# EAGLE design pCog100_Wifi_Sensor_TFT (EAGLE 6.6.0)

## Sheet 1 of 4
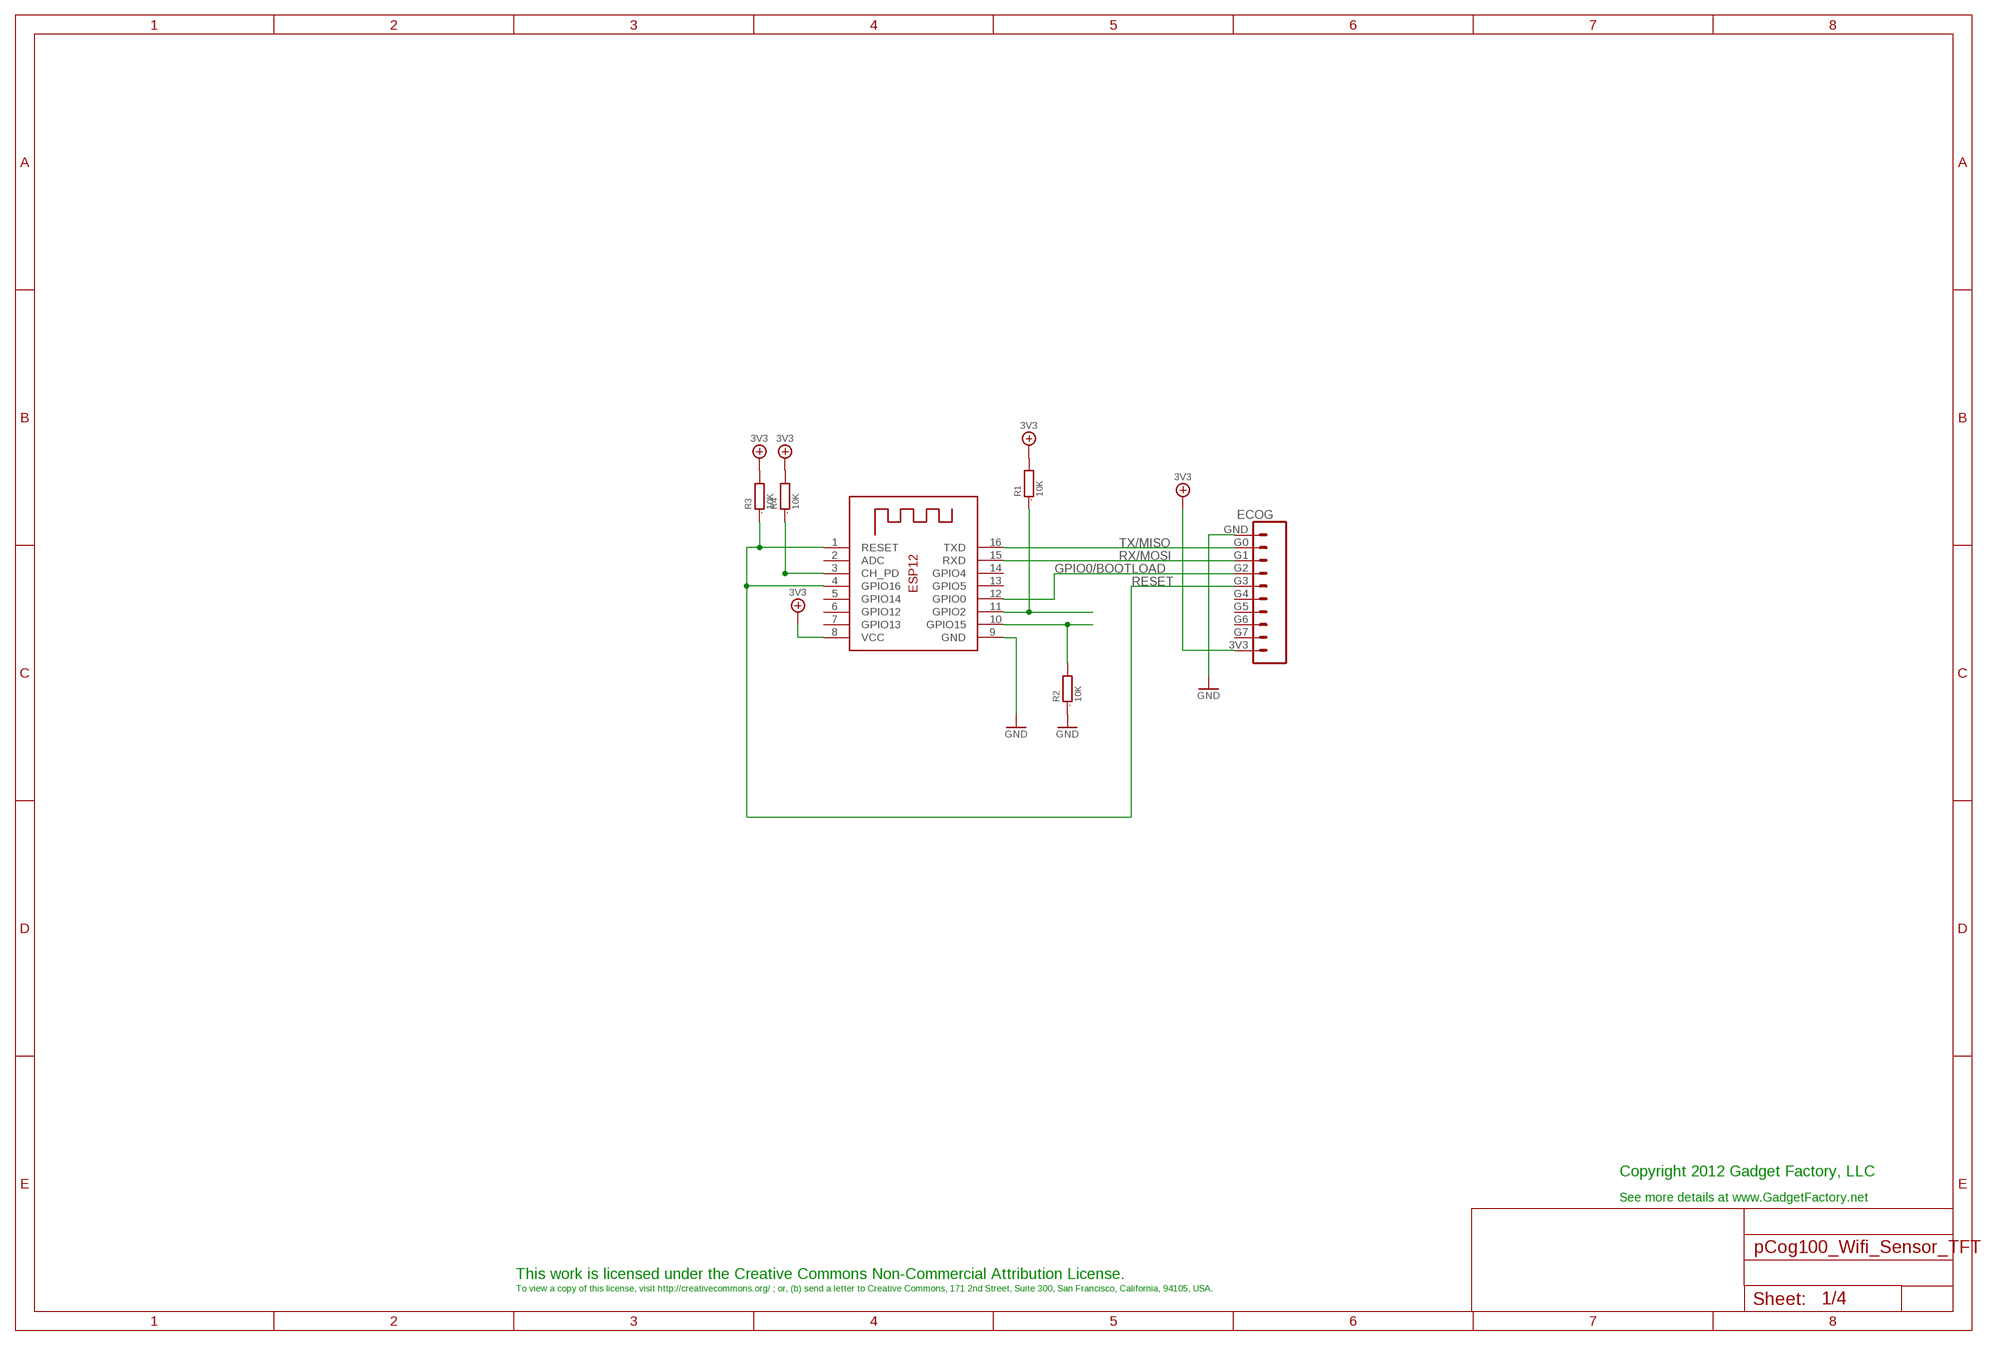
[diagram p0: schematic, sheet 1]

### Parts
ECOG  ECOG_GENERAL_ROWTHROUGHOLE  [ECOG_GENERAL_TH]
R1  10K  R0805  [0805]
R2  10K  R0805  [0805]
R3  10K  R0805  [0805]
R4  10K  R0805  [0805]
X1  ESP-12  [ESP-12]

### Nets
3V3: ECOG.3V3 R1.2 R3.2 R4.2 X1.8(VCC) ; also sheet 2,3,4
GND: ECOG.GND R2.1 X1.9(GND) ; also sheet 2,3,4
GPIO0/BOOTLOAD: ECOG.G2 X1.12(GPIO0)
N$3: R1.1 X1.11(GPIO2)
N$4: R2.2 X1.10(GPIO15)
N$5: R4.1 X1.3(CH_PD)
RESET: ECOG.G3 R3.1 X1.1(RESET) X1.4(GPIO16)
RX/MOSI: ECOG.G1 X1.15(RXD)
TX/MISO: ECOG.G0 X1.16(TXD)
Unconnected: ECOG.G4 ECOG.G5 ECOG.G6 ECOG.G7 X1.2(ADC) X1.5(GPIO14) X1.6(GPIO12) X1.7(GPIO13) X1.13(GPIO5) X1.14(GPIO4)

### Notes on the sheet
- Copyright 2012 Gadget Factory, LLC
- See more details at www.GadgetFactory.net
- This work is licensed under the Creative Commons Non-Commercial Attribution License.
- To view a copy of this license, visit http://creativecommons.org/ ; or, (b) send a letter to Creative Commons, 171 2nd Street, Suite 300, San Francisco, California, 94105, USA.

## Sheet 2 of 4
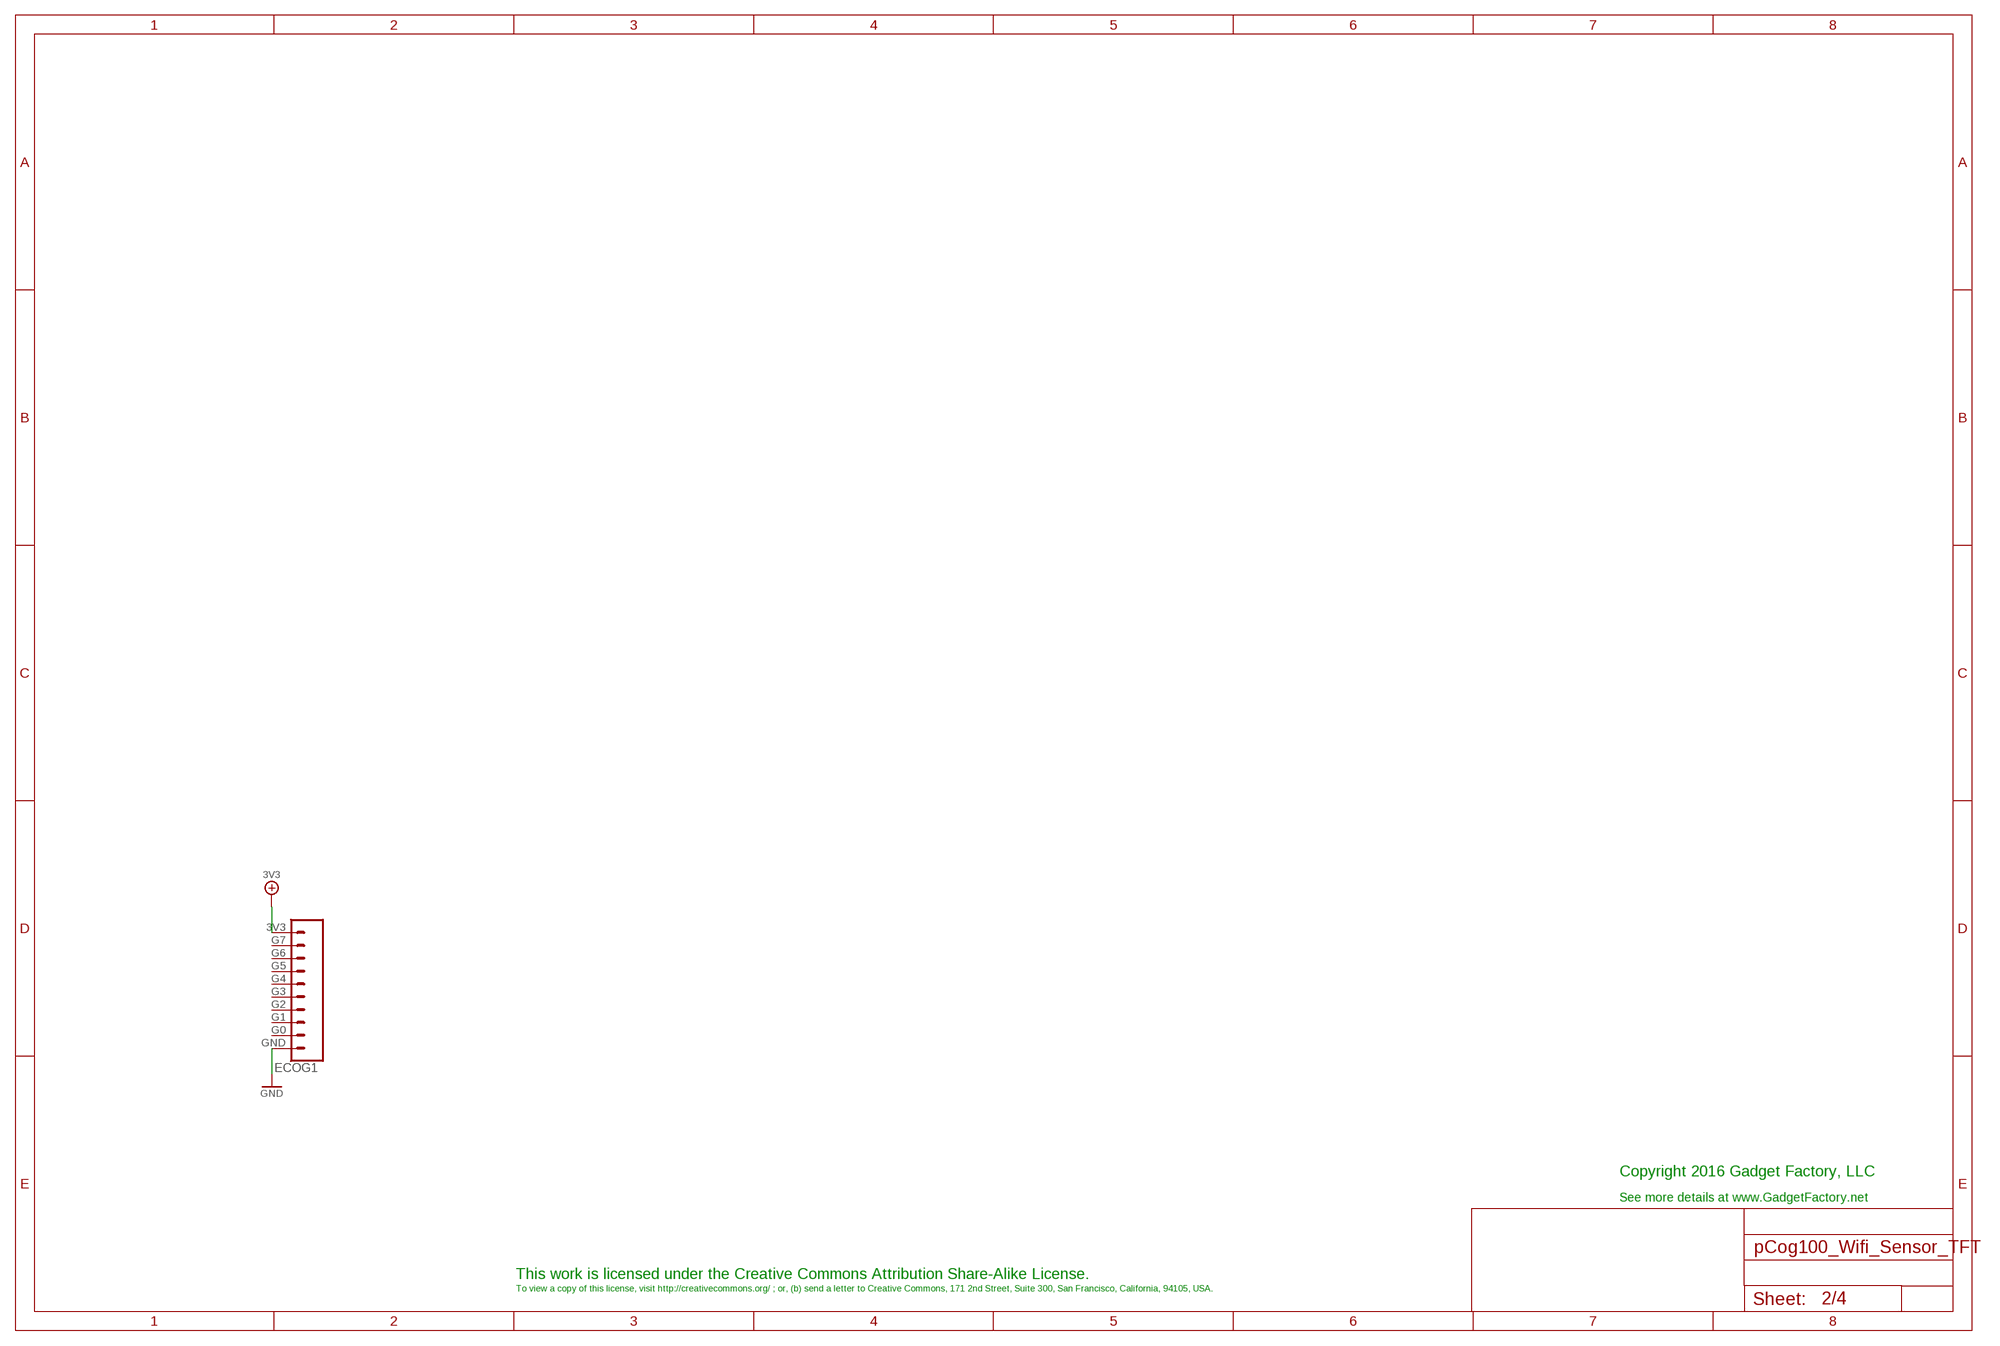
[diagram p1: schematic, sheet 2]

### Parts
ECOG1  ECOG_GENERAL_ROWSURFACEMOUNT  [ECOG_GENERAL_SMD]

### Nets
3V3: ECOG1.3V3 ; also sheet 1,3,4
GND: ECOG1.GND ; also sheet 1,3,4
Unconnected: ECOG1.G0 ECOG1.G1 ECOG1.G2 ECOG1.G3 ECOG1.G4 ECOG1.G5 ECOG1.G6 ECOG1.G7

### Notes on the sheet
- Copyright 2016 Gadget Factory, LLC
- See more details at www.GadgetFactory.net
- This work is licensed under the Creative Commons Attribution Share-Alike License.
- To view a copy of this license, visit http://creativecommons.org/ ; or, (b) send a letter to Creative Commons, 171 2nd Street, Suite 300, San Francisco, California, 94105, USA.

## Sheet 3 of 4
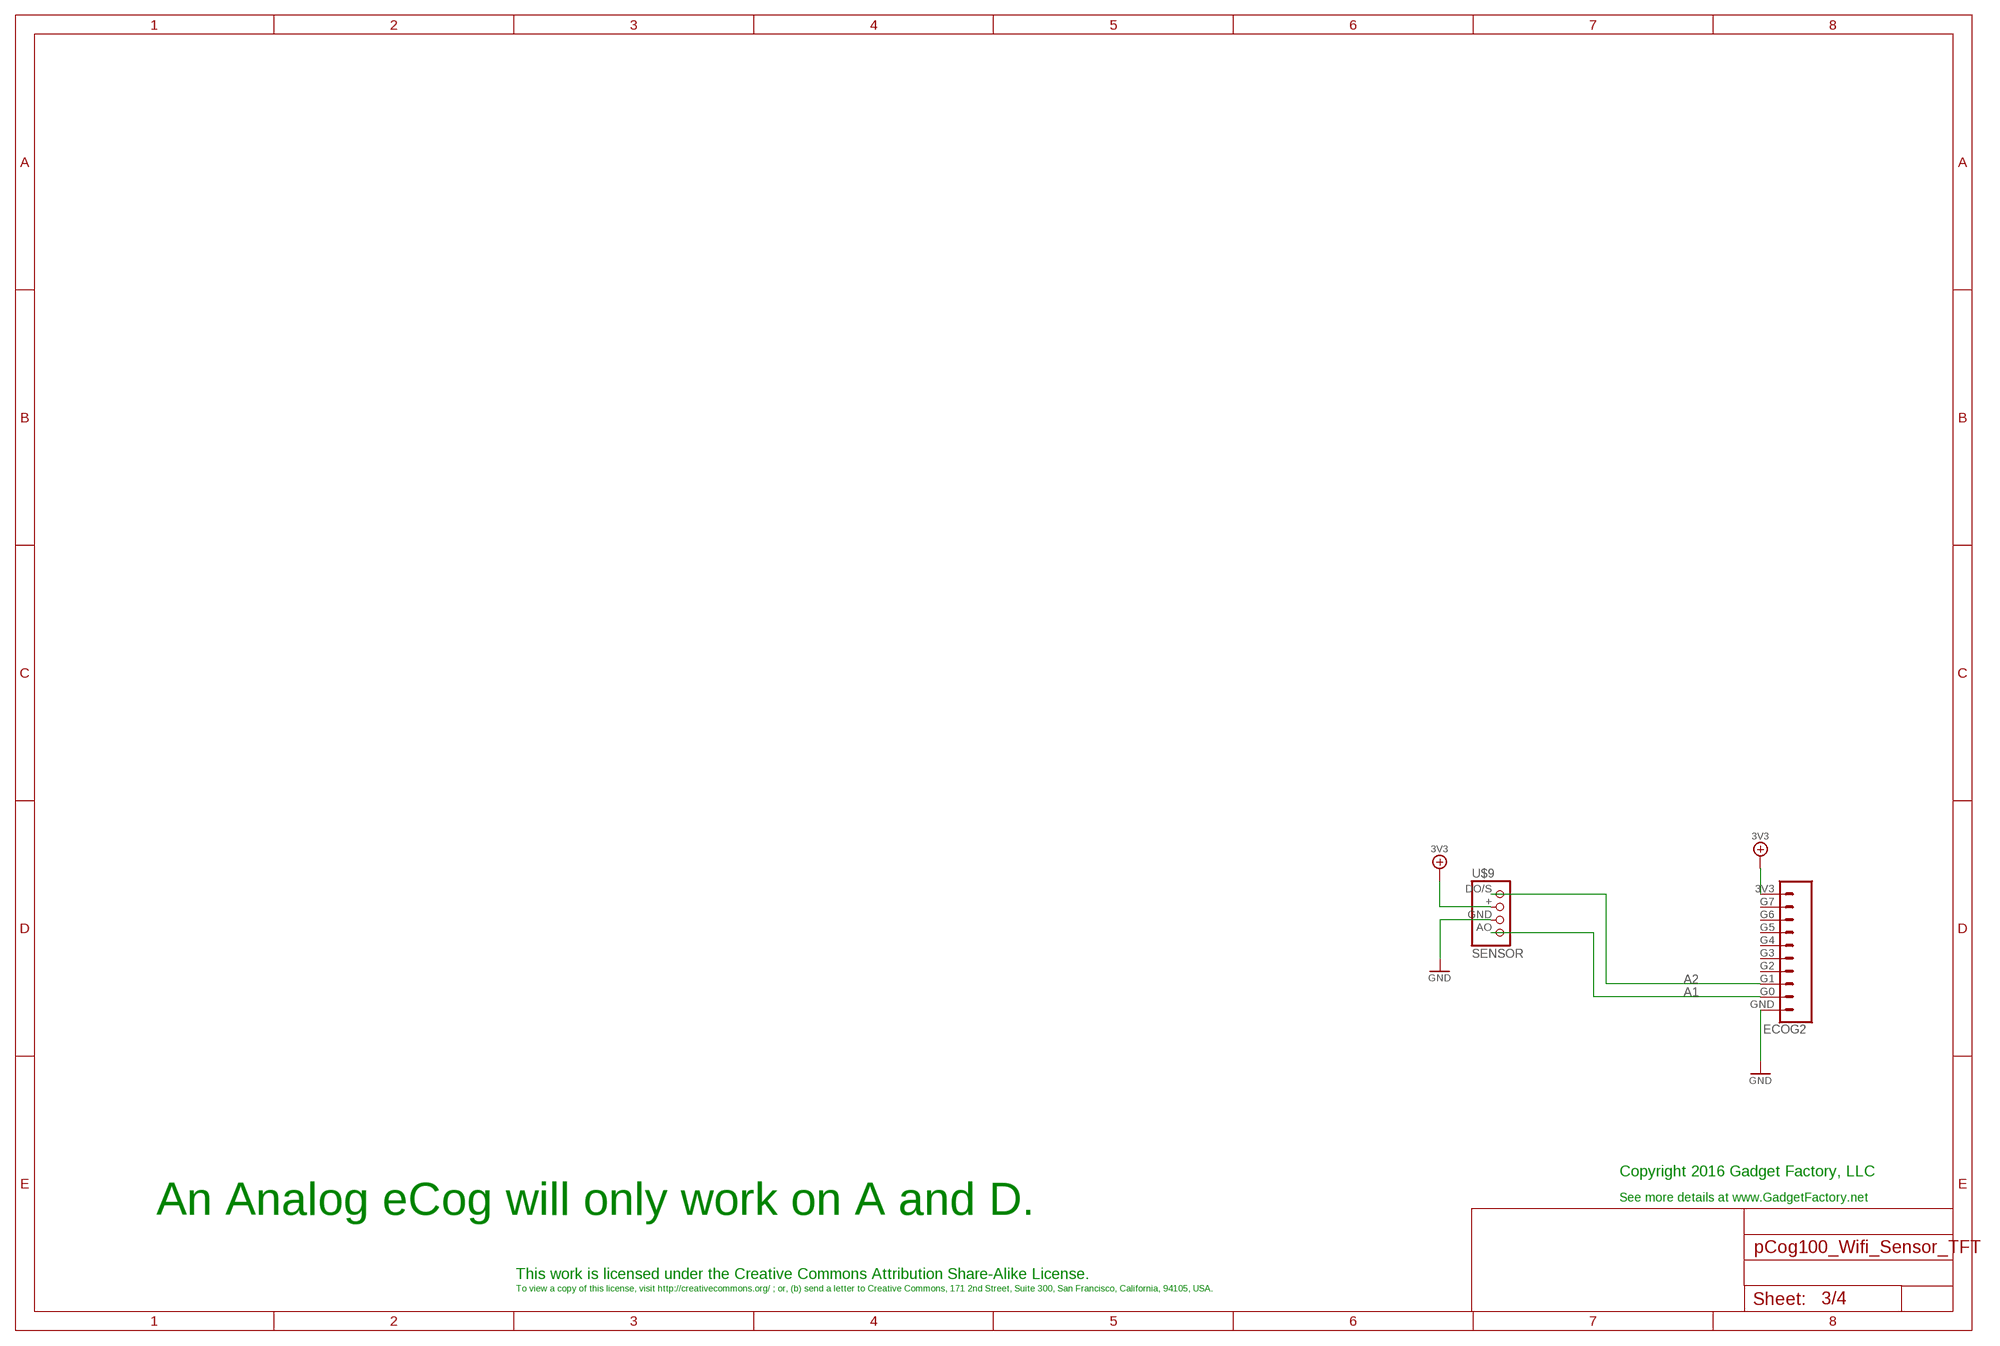
[diagram p2: schematic, sheet 3]

### Parts
ECOG2  ECOG_GENERAL_ROWTHROUGHOLE  [ECOG_GENERAL_TH]
U$9  SENSOR  [SENSOR-HJX4]

### Nets
3V3: ECOG2.3V3 U$9.+ ; also sheet 1,2,4
A1: ECOG2.G0 U$9.AO
A2: ECOG2.G1 U$9.DO/S
GND: ECOG2.GND U$9.GND ; also sheet 1,2,4
Unconnected: ECOG2.G2 ECOG2.G3 ECOG2.G4 ECOG2.G5 ECOG2.G6 ECOG2.G7

### Notes on the sheet
- Copyright 2016 Gadget Factory, LLC
- See more details at www.GadgetFactory.net
- An Analog eCog will only work on A and D.
- This work is licensed under the Creative Commons Attribution Share-Alike License.
- To view a copy of this license, visit http://creativecommons.org/ ; or, (b) send a letter to Creative Commons, 171 2nd Street, Suite 300, San Francisco, California, 94105, USA.

## Sheet 4 of 4
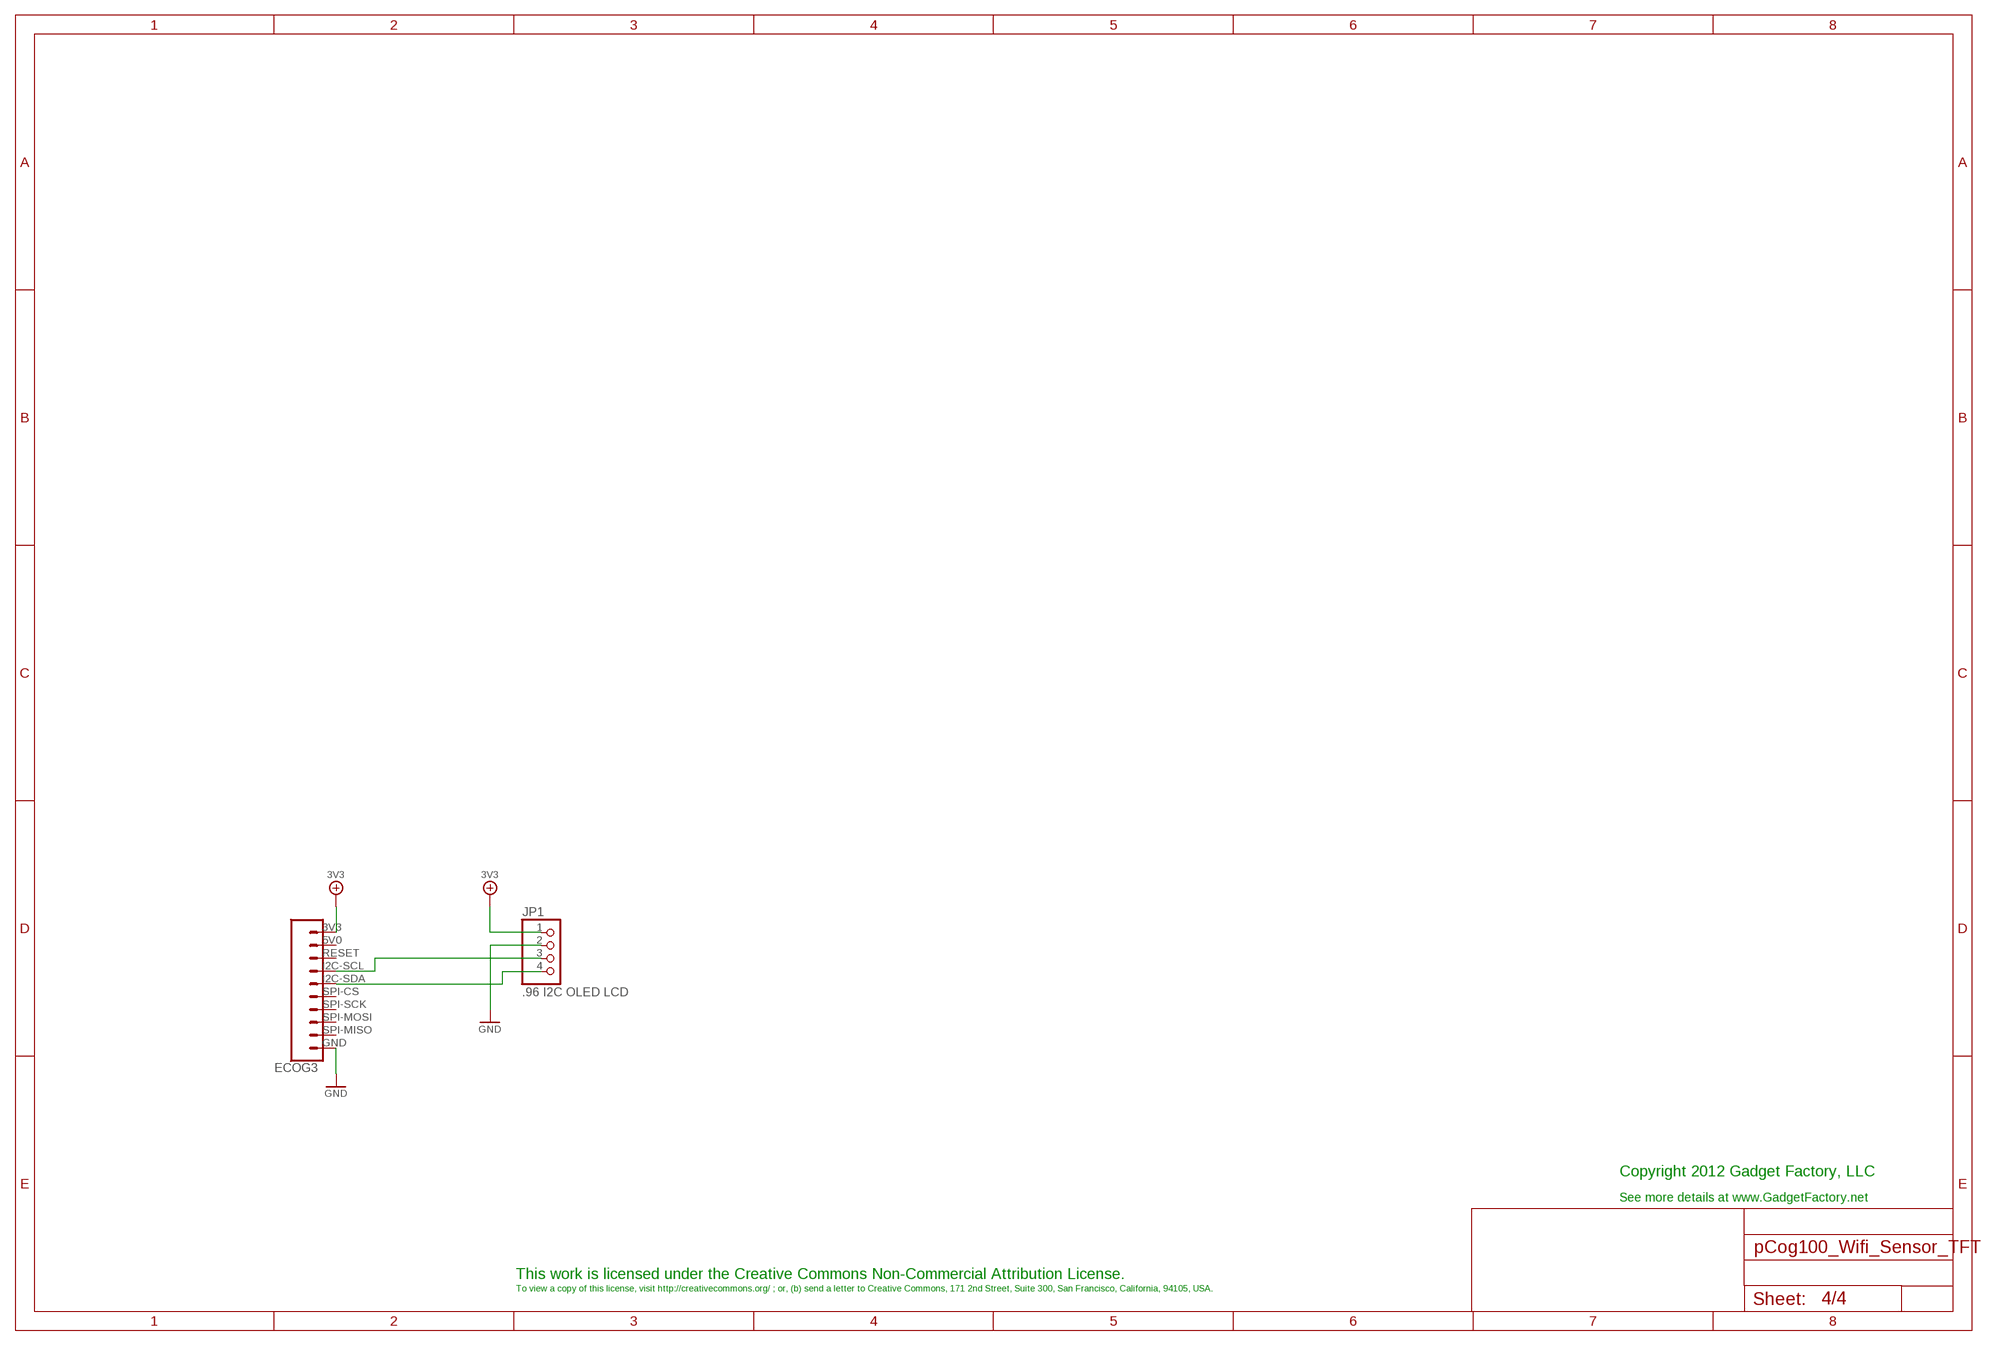
[diagram p3: schematic, sheet 4]

### Parts
ECOG3  ECOG_BUSES_ROWTHROUGHHOLE  [ECOG_BUSES_TH]
JP1  .96 I2C OLED LCD  PINHD-1X4  [1X04]

### Nets
3V3: ECOG3.3V3 JP1.1 ; also sheet 1,2,3
GND: ECOG3.GND JP1.2 ; also sheet 1,2,3
N$1: ECOG3.I2C-SCL JP1.3
N$2: ECOG3.I2C-SDA JP1.4
Unconnected: ECOG3.5V0(RSV) ECOG3.RESET(RSV) ECOG3.SPI-CS ECOG3.SPI-MISO ECOG3.SPI-MOSI ECOG3.SPI-SCK

### Notes on the sheet
- Copyright 2012 Gadget Factory, LLC
- See more details at www.GadgetFactory.net
- This work is licensed under the Creative Commons Non-Commercial Attribution License.
- To view a copy of this license, visit http://creativecommons.org/ ; or, (b) send a letter to Creative Commons, 171 2nd Street, Suite 300, San Francisco, California, 94105, USA.

## Library data of the parts
ECOG ECOG2 = eCogs:ECOG_GENERAL_ROW
ECOG1 = eCogs:ECOG_GENERAL_ROW; DIGIKEY: S1013EC-10-ND
ECOG3 = eCogs:ECOG_BUSES_ROW
JP1 = pinhead:PINHD-1X4: PIN HEADER; DEALEXTREME: 419232
R1-R4 = GadgetFactory:R: RESISTOR, European symbol; DIGIKEY: RMCF0805JT10K0CT-ND
U$9 = eCogs:SENSOR
X1 = adafruit:ESP-12; ADAFRUIT: 2491

## Board
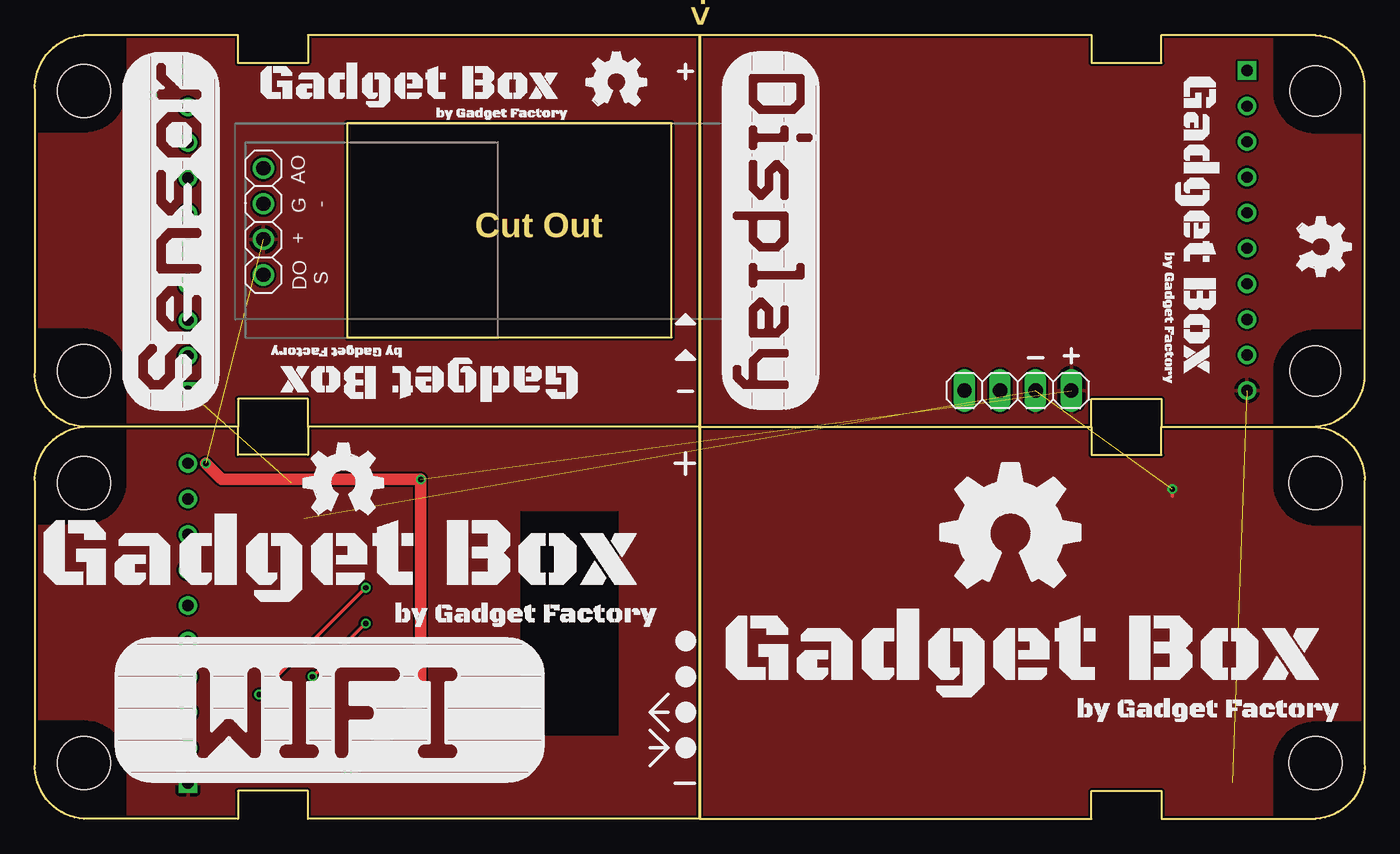
[diagram p4: board, top side]
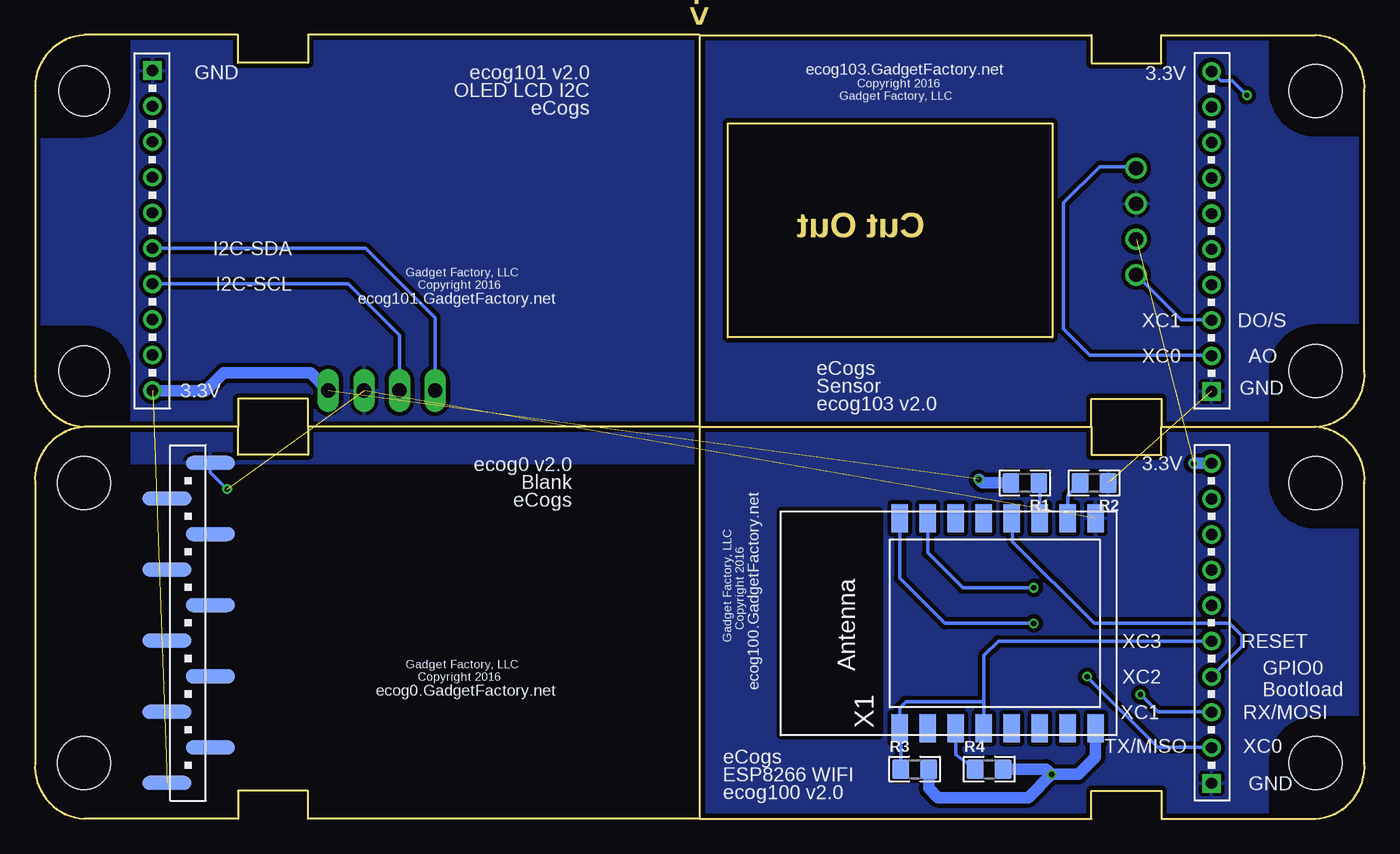
[diagram p5: board, bottom side, seen from below]

Size 95.01 x 56 mm. Coordinates in mm from the lower left corner, seen from the top.
Copper layers (1*16): Top 0.035mm / dielectric 1.5mm / Bottom 0.035mm
Design rules "hackvana": minimum track width 6mil, minimum drill 0.3mm, track to track 6mil, track to pad 6mil, pad to pad 6mil, via to via 6mil, smd to smd 0mil, copper to edge 6mil, drill to drill 6mil, minimum pad ring 10mil, minimum via ring 6mil, stop-mask expansion 2mil, vias tented up to drill 100mil, thermal gap 10mil

### Footprints (pad centres in the part's own frame; a part is rotated, then mirrored left to right if it is on the bottom)
ECOG_GENERAL_TH = drill 0.8: 3V3 11.43,25.4; G0 11.43,5.08; G1 11.43,7.62; G2 11.43,10.16; G3 11.43,12.7; G4 11.43,15.24; G5 11.43,17.78; G6 11.43,20.32; G7 11.43,22.86 | drill 0.8 square: GND 11.43,2.54 | hole 3.8: 4,24; 4,4
ECOG_GENERAL_SMD = smd 3.5 x 1 bottom: 3V3 9.923,25.429; G0 9.923,5.111; G1 13.022,7.649; G2 9.923,10.189; G3 13.022,12.729; G4 9.923,15.269; G5 13.022,17.809; G6 9.923,20.349; G7 13.022,22.889; GND 13.022,2.571 | hole 3.8: 4,24; 4,4
ECOG_BUSES_TH = drill 0.8: 3V3 8.89,25.4; 5V0 8.89,22.86; I2C-SCL 8.89,17.78; I2C-SDA 8.89,15.24; RESET 8.89,20.32; SPI-CS 8.89,12.7; SPI-MISO 8.89,5.08; SPI-MOSI 8.89,7.62; SPI-SCK 8.89,10.16 | drill 0.8 square: GND 8.89,2.54 | hole 3.6: 4.004,24.003; 4.004,4.003
1X04 = drill 1.016 long: 1 -3.81,0; 2 -1.27,0; 3 1.27,0; 4 3.81,0
0805 = smd 1.2 x 1.4: 1 -1,0; 2 1,0
SENSOR-HJX4 = drill 1.016: + -1.29,-2.01; AO 3.79,-2.01; DO/S -3.83,-2.01; GND 1.25,-2.01
ESP-12 = smd 2 x 1.2: 1 -7.5,4.5; 2 -7.5,2.5; 3 -7.5,0.5; 4 -7.5,-1.5; 5 -7.5,-3.5; 6 -7.5,-5.5; 7 -7.5,-7.5; 8 -7.5,-9.5; 9 7.5,-9.5; 10 7.5,-7.5; 11 7.5,-5.5; 12 7.5,-3.5; 13 7.5,-1.5; 14 7.5,0.5; 15 7.5,2.5; 16 7.5,4.5

### Placement (x,y rotation side)
ECOG  -0.49,0 0 top
ECOG1  95.51,28 180 top
ECOG2  -0.49,28 0 top
ECOG3  95.51,56 180 top
JP1  70.24,30.6 180 top
R1  24.27,24 180 bottom
R2  19.32,24 180 bottom
R3  32.15,3.56 0 bottom
R4  26.81,3.56 0 bottom
U$1  [GADGETBOX_TEXT]  21.88,18.44 0 top
U$2  [LEGEND_DIO]  46.5,12.7 0 top
U$3  [LEGEND_DIO]  46.5,10.16 0 top
U$4  [LEGEND_DIO]  46.5,7.62 0 top
U$5  [LEGEND_DIO]  46.5,5.08 0 top
U$6  [OSHW_FILLX200_NOTEXT]  19.2,21.76 0 top
U$7  [GADGETBOX_TEXT]  70.64,11.64 0 top
U$8  [OSHW_FILLX350_NOTEXT]  64.75,16.54 0 top
U$9  14.31,42.69 90 top
U$10  [LEGEND_ANALOG]  46.5,35.62 0 top
U$11  [LEGEND_ANALOG]  46.5,33.08 0 top
U$12  [GADGETBOX_SMALL]  26.81,52.36 0 top
U$13  [OSHW_FILLX150_NOTEXT]  39.42,50.96 0 top
U$14  [GADGETBOX_SMALL]  28.08,31.43 180 top
U$15  [GADGETBOX_SMALL]  82.98,42.35 270 top
U$16  [OSHW_FILLX150_NOTEXT]  90.21,43 270 top
X1  28.72,13.97 90 bottom

### Tracks (layer width: path | path; a pad name or v marks a point on that pad's centre or on a via)
3V3  (via drill 0.38)  (3 unrouted)
  Top 0.254: v8.41,51.7 8.21,51.7 8.11,51.6
  Top 0.813: v22.37,3.18 27.57,8.38 v27.57,24.26 13.35,24.26 v12.21,25.4
  Bottom 0.254: v8.41,51.7 9.43,52.72 10.26,52.72 ECOG2.3V3
  Bottom 0.813: 19.13,6.38 X1.8 19.22,4.42 20.46,3.18 v22.37,3.18 | R4.2 22.75,3.56 v22.37,3.18 | R3.2 31.15,2.18 30.49,1.52 24.02,1.52 v22.37,3.18 | R1.2 27.32,24 v27.57,24.26 | JP1.1 75.32,31.87 81.54,31.87 82.81,30.6 ECOG3.3V3 | v12.21,25.4 ECOG.3V3
  pour Top: -1.76,57.27 48.78,57.27 48.78,26.73 -1.76,26.73
  pour Top: 96.78,26.73 46.24,26.73 46.24,57.27 96.78,57.27
A1
  Bottom 0.254: U$9.AO 16.43,46.6 18.91,46.6 21.51,44 21.51,35 19.62,33.11 10.97,33.11 ECOG2.G0
A2
  Bottom 0.254: U$9.DO/S 13.1,35.65 10.97,35.65 ECOG2.G1
GND  (via drill 0.38)  (3 unrouted)
  Top 0.254: v81.28,23.55 81.28,23.05
  Bottom 0.254: ECOG1.GND 82.48,24.76 v81.28,23.55
  pour Bottom (isolate 0.305): -0.49,28 47.51,28 47.51,0 -0.49,0
  pour Top: -0.49,27.94 47.77,27.94 47.77,0 -0.49,0
  pour Top: 96.51,-1 46.51,-1 46.51,29 96.51,29
  pour Bottom (isolate 0.305): -3.03,58.54 50.05,58.54 50.05,25.46 -3.03,25.46
  pour Bottom (isolate 0.305): 98.05,25.46 44.97,25.46 44.97,58.54 98.05,58.54
GPIO0/BOOTLOAD
  Bottom 0.254: X1.12 25.16,21.41 25.16,19.81 19.32,13.97 9.67,13.97 8.78,13.08 8.78,12.32 ECOG.G2
N$1
  Bottom 0.254: ECOG3.I2C-SCL 72.65,38.22 68.97,34.54 JP1.3
N$2
  Bottom 0.254: ECOG3.I2C-SDA 71.38,40.76 66.43,35.81 JP1.4
N$3
  Bottom 0.254: X1.11 23.22,23.95 R1.1
N$4
  Bottom 0.254: X1.10 21.22,23.11 R2.2
N$5
  Bottom 0.254: X1.3 29.22,4.58 R4.1
RESET
  Bottom 0.254: 27.19,8.38 27.19,6.49 X1.4 | R3.1 33.15,6.4 X1.1 33.22,7.95 32.78,8.38 27.19,8.38 | 27.19,8.38 27.19,11.68 26.18,12.7 ECOG.G3
RX/MOSI  (via drill 0.38)
  Top 0.254: v16.02,8.89 v23.64,16.51
  Bottom 0.254: 31.26,21.51 X1.15 31.22,19.01 28.72,16.51 v23.64,16.51 | v16.02,8.89 14.78,7.65 10.97,7.65 ECOG.G1
TX/MISO  (via drill 0.38)
  Top 0.254: v19.83,10.16 v23.64,13.97
  Bottom 0.254: 33.03,21.65 X1.16 33.22,17.2 29.99,13.97 v23.64,13.97 | v19.83,10.16 14.78,5.11 10.97,5.11 ECOG.G0

### Text on the board
Dimension: <----vScore | Cut Out | <----vScore | vScore----> | vScore---->
bPlace: ecog101 v2.0 | GND | 3.3V | ecog103.GadgetFactory.net | OLED LCD I2C | Copyright 2016 | Gadget Factory, LLC | eCogs | I2C-SDA | Gadget Factory, LLC | I2C-SCL | ecog101.GadgetFactory.net | Copyright 2016 | DO/S | XC1 | AO | XC0 | eCogs | 3.3V | GND | Sensor | ecog103 v2.0 | ecog0 v2.0 | 3.3V | Blank | ecog100.GadgetFactory.net | eCogs | Gadget Factory, LLC | Copyright 2016 | RESET | XC3 | Gadget Factory, LLC | XC2 | ecog0.GadgetFactory.net | Copyright 2016 | GPIO0 / Bootload | RX/MOSI | XC1 | XC0 | TX/MISO | eCogs | ESP8266 WIFI | GND | ecog100 v2.0